# EasyEDA schematic SCH_CLASS_ESP32-S2-MAIN_2024-03-12 (1).json
TITLE: ESP32_S2-MAIN-CONTROL; REV: 1.9; Date: 2023-12-26; Sheet: 1/1; Drawn By: aamirf; Company: Your Company
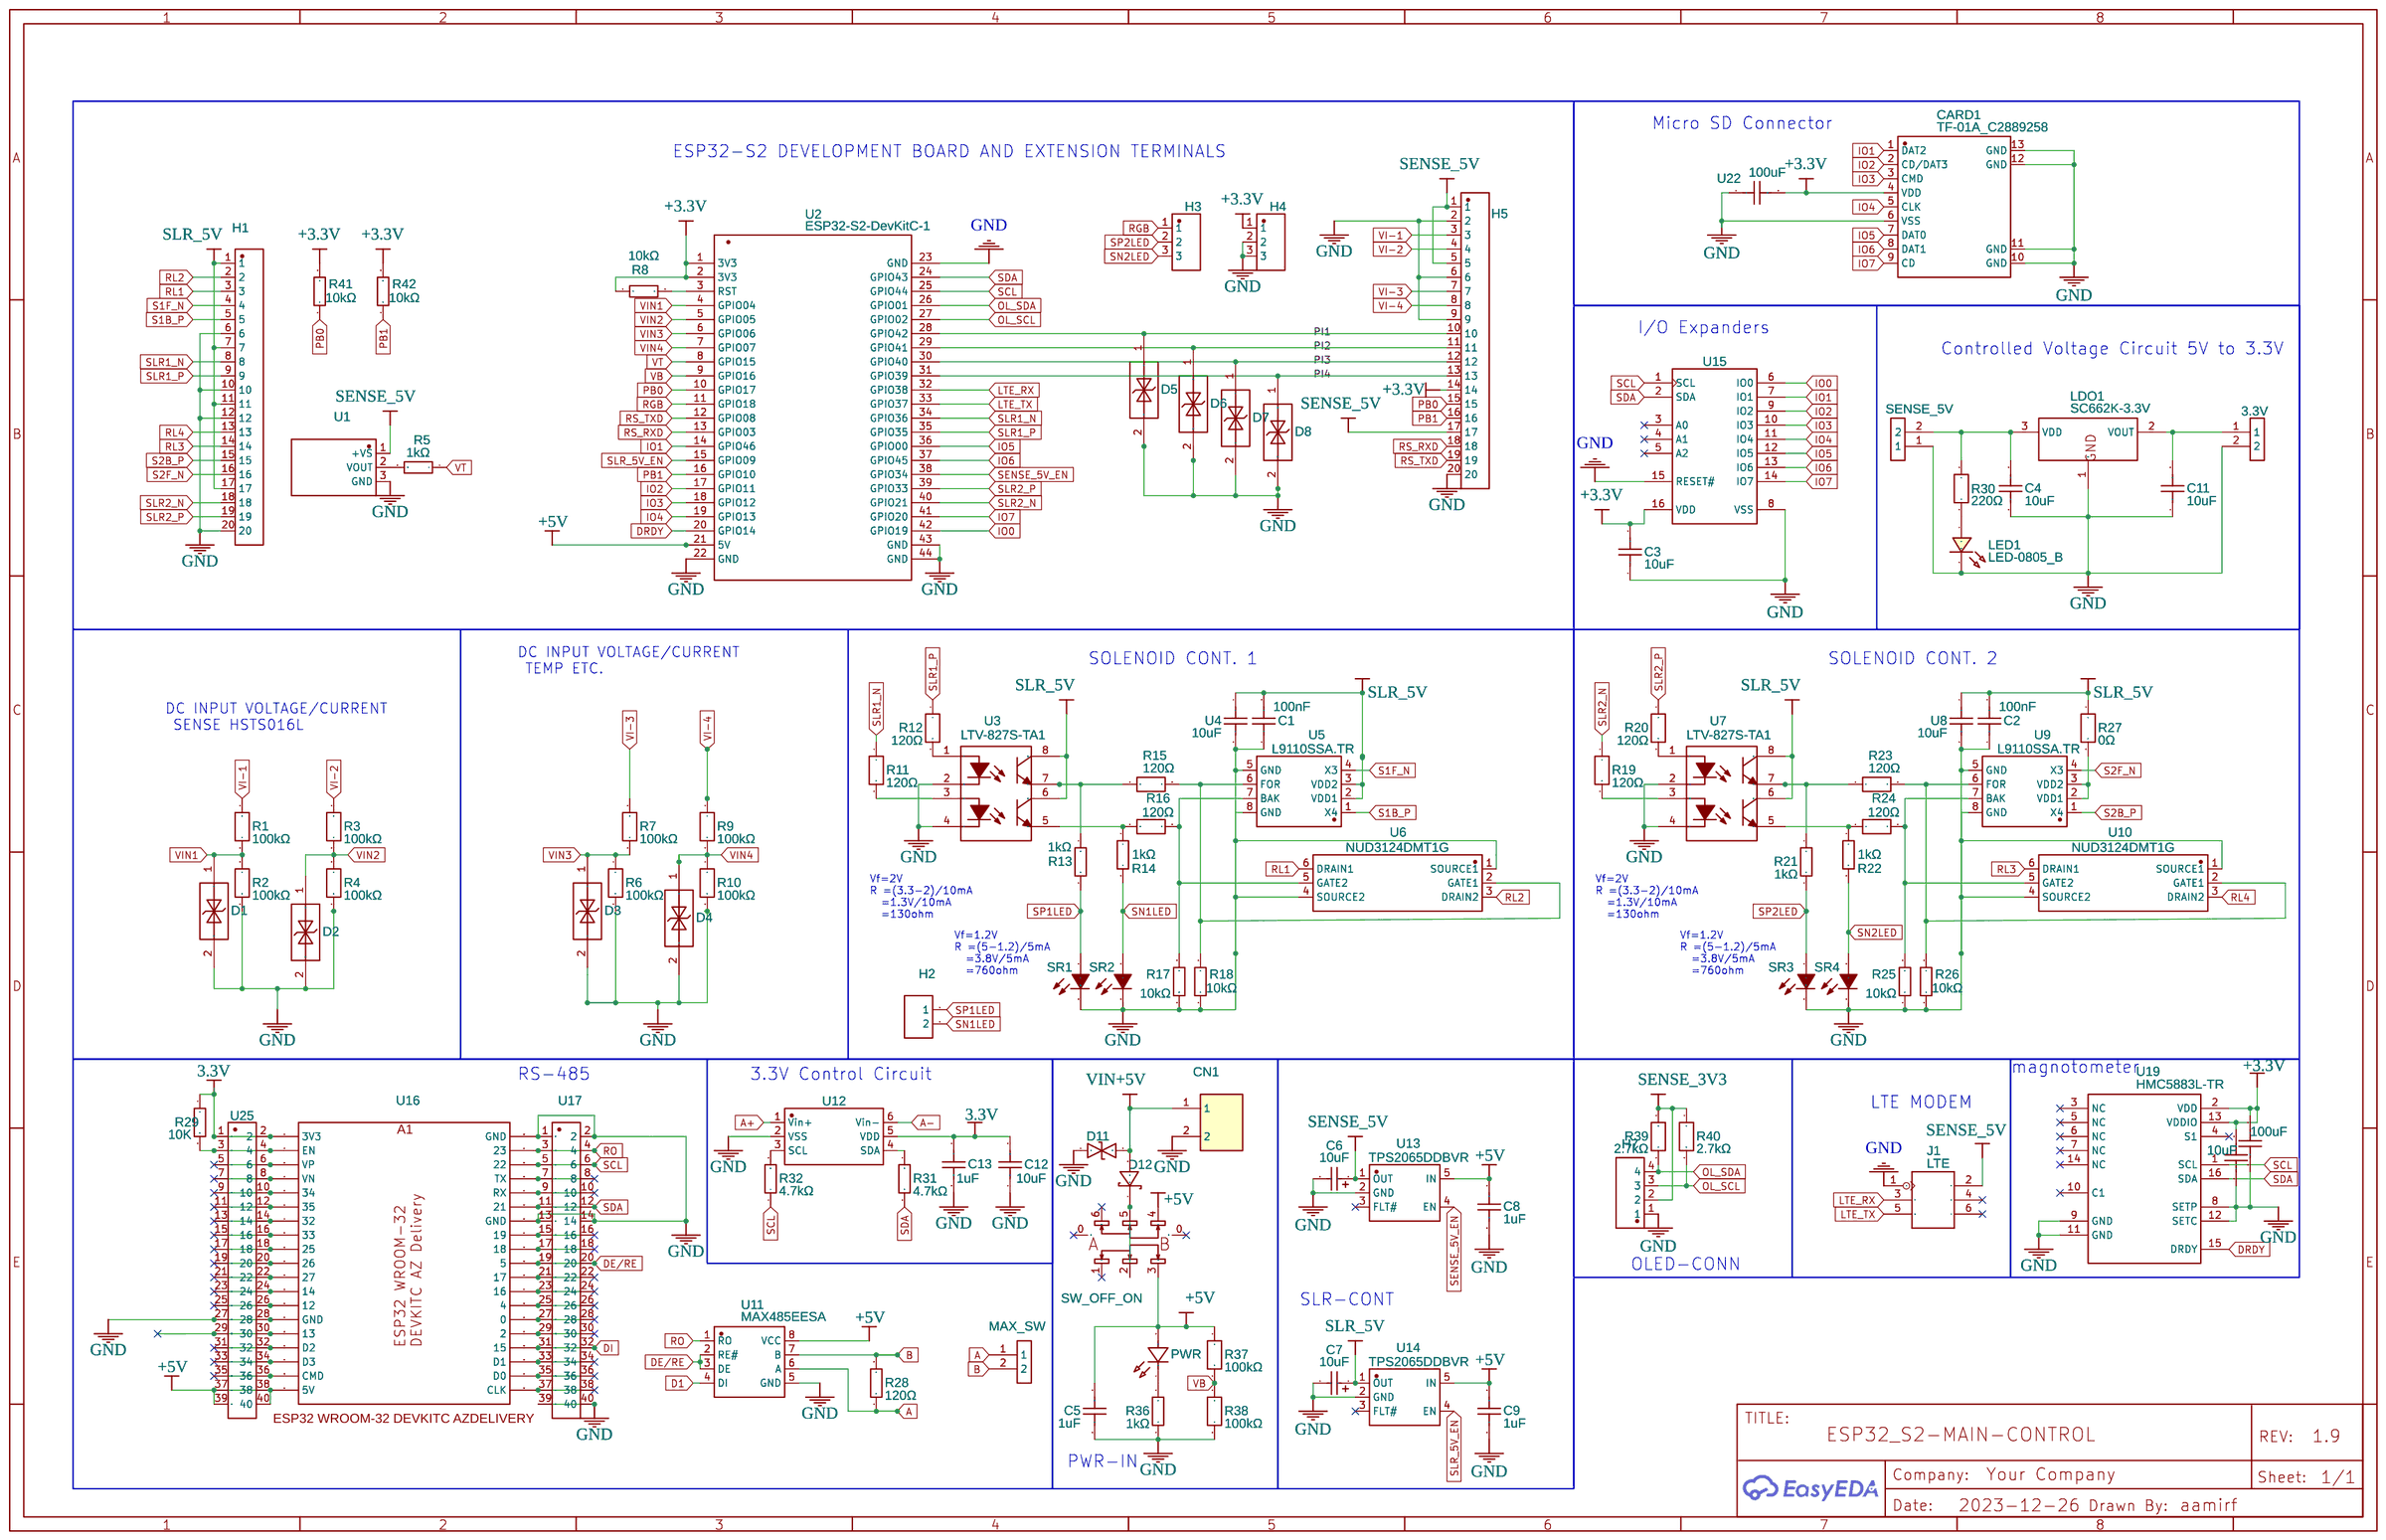
[diagram p0: schematic sheet]

## Parts
C1  100nF  [C0402]
C2  100nF  [C0402]
C3  10uF  [C0805]
C4  10uF  [C0805]
C5  1uF  [C0402]
C6  10uF  [CASE-A_3216]
C7  10uF  [CASE-A_3216]
C8  1uF  [C0402]
C9  1uF  [C0402]
C10  10uF  [C1206]
C11  10uF  [C0805]
C12  10uF  [C0805]
C13  1uF  [C0402]
CARD1  TF-01A_C2889258  [TF-SMD_TF-02]
CN1  B2B-PH-K-S(LF)(SN)  [CONN-TH_B2B-PH-K-S]
D1  KESD5311X  [D0402-BI]
D2  KESD5311X  [D0402-BI]
D3  KESD5311X  [D0402-BI]
D4  KESD5311X  [D0402-BI]
D5  KESD5311X  [D0402-BI]
D6  KESD5311X  [D0402-BI]
D7  KESD5311X  [D0402-BI]
D8  KESD5311X  [D0402-BI]
D11  LESD5D5.0CT1G  [SOD-523_L1.2-W0.8-LS1.6-BI]
D12  BAT760-7  [SOD-323_L1.8-W1.3-LS2.5-RD]
H1  KH-2.54PH180-1X20P-L11.5  [HDR-TH_20P-P2.54-V-M]
H2  HDR-F-2.54_1x2  [HDR-F-2.54_1X2]
H3  KH-2.54PH180-1X3P-L11.5  [HDR-TH_3P-P2.54-V-M]
H4  KH-2.54PH180-1X3P-L11.5  [HDR-TH_3P-P2.54-V-M]
H5  KH-2.54PH180-1X20P-L11.5  [HDR-TH_20P-P2.54-V-M]
H7  X6511WV-04H-C30D60  [HDR-TH_4P-P2.54-V-M]
J1  LTE  [HEADER 2X3-2.54]
LDO1  SC662K-3.3V  [SOT-23-3_L2.9-W1.3-P1.90-LS2.4-BR]
LED1  LED-0805_B  [LED0805_BLUE]
PWR  16-213/BHC-ZL1M2B6Y/3T  [LED0402-RD_BLUE]
PWR_1V  MAX_SW  [CONN-02-5-SMD]
PWR_2V  SENSE_5V  [CONN-02-5-SMD]
PWR_3V  3.3V  [CONN-02-5-SMD]
R1  100kΩ  [R0402]
R2  100kΩ  [R0402]
R3  100kΩ  [R0402]
R4  100kΩ  [R0402]
R5  1kΩ  [R0402]
R6  100kΩ  [R0402]
R7  100kΩ  [R0402]
R8  10kΩ  [R0402]
R9  100kΩ  [R0402]
R10  100kΩ  [R0402]
R11  120Ω  [R0402]
R12  120Ω  [R0402]
R13  1kΩ  [R0402]
R14  1kΩ  [R0402]
R15  120Ω  [R0402]
R16  120Ω  [R0402]
R17  10kΩ  [R0402]
R18  10kΩ  [R0402]
R19  120Ω  [R0402]
R20  120Ω  [R0402]
R21  1kΩ  [R0402]
R22  1kΩ  [R0402]
R23  120Ω  [R0402]
R24  120Ω  [R0402]
R25  10kΩ  [R0402]
R26  10kΩ  [R0402]
R27  0Ω  [R0603]
R28  120Ω  [R0402]
R29  10K  [R0603]
R30  220Ω  [R0402]
R31  4.7kΩ  [R0402]
R32  4.7kΩ  [R0402]
R36  1kΩ  [R0402]
R37  100kΩ  [R0402]
R38  100kΩ  [R0402]
R39  2.7kΩ  [R0402]
R40  2.7kΩ  [R0402]
R41  10kΩ  [R0402]
R42  10kΩ  [R0402]
SR1  16-213/GHC-YR1S1/3T  [LED0402-R-RD]
SR2  16-213/SDRC/S530-A3/TR8  [LED0402-RD]
SR3  16-213/GHC-YR1S1/3T  [LED0402-R-RD]
SR4  16-213/SDRC/S530-A3/TR8  [LED0402-RD]
SW1  SW_OFF_ON  [SW-SMD_6P-L7.7-W5.6-P2.50]
U1  LM35DZ/LFT1  [TO-92-3_L4.8-W3.7-P2.54-L]
U2  ESP32-S2-DevKitC-1  [ESP32-S2-DEVKITC-1]
U3  LTV-827S-TA1  [SMD-8_6.3MM]
U4  10uF  [C0603]
U5  L9110SSA.TR  [SOP-8_L5.0-W3.9-P1.27-LS6.0-BL]
U6  NUD3124DMT1G  [SC-74-6_L3.0-W1.5-P0.95-LS2.8-BL]
U7  LTV-827S-TA1  [SMD-8_6.3MM]
U8  10uF  [C0603]
U9  L9110SSA.TR  [SOP-8_L5.0-W3.9-P1.27-LS6.0-BL]
U10  NUD3124DMT1G  [SC-74-6_L3.0-W1.5-P0.95-LS2.8-BL]
U11  MAX485EESA  [SOIC-8_L5.0-W4.0-P1.27-LS6.0-BL]
U12  MCP3421A0T-E/CH  [SOT-23-6_L2.9-W1.6-P0.95-LS2.8-BR]
U13  TPS2065DDBVR  [SOT-23-5_L3.0-W1.7-P0.95-LS2.8-BL]
U14  TPS2065DDBVR  [SOT-23-5_L3.0-W1.7-P0.95-LS2.8-BL]
U15  PCA9557PW,118  [TSSOP-16_L5.0-W4.4-P0.65-LS6.4-BL]
U16  ESP_32_40_SMD_symbol  [ESP_32_SMD_FOOTPRINT]
U17  SCHLIB_C2685092Connector_SMD_40pin  [C2685092CONNECTOR_SMD_FOOTPRINT]
U18  100uF  [C1206]
U19  HMC5883L-TR  [LGA-16_L3.0-W3.0-P0.50-BL_SQ]
U22  100uF  [C1206]
U25  SCHLIB_C2685092Connector_SMD_40pin  [C2685092CONNECTOR_SMD_FOOTPRINT]

## Library data of the parts
C1 C2 = C1005X5R0J104K050BA: Contributor: lcsc; Supplier: LCSC; Supplier Part: C3845188; Manufacturer: TDK; link: https://lcsc.com/eda_search?q=C3845188&%26type=1&ref=editor
C3 C12 = C2012X5R1E106M125AB: Contributor: lcsc; Supplier: LCSC; Supplier Part: C3853143; Manufacturer: TDK
C4 C11 = C2012JB1E106K085AC: Contributor: lcsc; Supplier: LCSC; Supplier Part: C3902947; Manufacturer: TDK
C5 C8 C9 C13 = GRM155R61H105ME05D: Contributor: lcsc; Supplier: LCSC; Supplier Part: C5119299; Manufacturer: muRata(村田); JLCPCB Part Class: Extended Part; link: https://lcsc.com/eda_search?q=C5119299&%26type=1&ref=editor
C6 C7 = CA45A-A-16V-10UF-K: Contributor: LCSC; Supplier: LCSC; Manufacturer: CEC(振华新云); Manufacturer Part: CA45A-A-16V-10uF-K; Supplier Part: C129279; JLCPCB Part Class: Extended Part
C10 = C3216JB1C106M085AB: Contributor: lcsc; Supplier: LCSC; Supplier Part: C3874147; Manufacturer: TDK
CARD1 = TF-01A_C2889258: Contributor: LCSC; Supplier: LCSC; Supplier Part: C2889258; Manufacturer: Yuandi(台湾元迪); Manufacturer Part: TF-01A; JLCPCB Part Class: Extended Part
CN1 = B2B-PH-K-S(LF)(SN): Contributor: LCSC; Supplier: LCSC; Manufacturer: JST; Supplier Part: C131337; JLCPCB Part Class: Extended Part; link: https://lcsc.com/eda_search?q=C131337&%26type=1&ref=editor
D1-D8 = KESD5311X: Contributor: lcsc; Supplier: LCSC; Supplier Part: C2892495; Manufacturer: KUU; JLCPCB Part Class: Extended Part
D11 = LESD5D5.0CT1G: Contributor: LCSC; Supplier: LCSC; Supplier Part: C383211; Manufacturer: LRC(乐山无线电); JLCPCB Part Class: Extended Part; link: https://lcsc.com/eda_search?q=C383211&%26type=1&ref=editor
D12 = BAT760-7: Contributor: LCSC; Supplier: LCSC; Manufacturer: DIODES(美台); Supplier Part: C124187; JLCPCB Part Class: Extended Part; link: https://lcsc.com/eda_search?q=C124187&%26type=1&ref=editor
H1 H5 = KH-2.54PH180-1X20P-L11.5: Contributor: LCSC; Supplier: LCSC; Supplier Part: C2905493; Manufacturer: kinghelm(金航标); JLCPCB Part Class: Extended Part
H2 = HDR-F-2.54_1x2: Supplier Part: C49661; Supplier: LCSC; Contributor: LCEDA_Lib
H3 H4 = KH-2.54PH180-1X3P-L11.5: Contributor: LCSC; Supplier: LCSC; Supplier Part: C2932698; Manufacturer: kinghelm(金航标); JLCPCB Part Class: Extended Part
H7 = X6511WV-04H-C30D60: Contributor: LCSC; Supplier: LCSC; Supplier Part: C706876; Manufacturer: XKB Connectivity(中国星坤); JLCPCB Part Class: Extended Part
J1 = MALE-HEADER(2X3P-2.54): Contributor: hphoa
LDO1 = SC662K-3.3V: Supplier: LCSC; Manufacturer: FM(富满); Supplier Part: C83932; JLCPCB Part Class: Extended Part
LED1 = LED-0805_B: Manufacturer: 方舟 ARKLED; Manufacturer Part: D-B080508B1-KS2; Supplier Part: C108412; Contributor: LCEDA_Lib
PWR = 16-213/BHC-ZL1M2B6Y/3T: Contributor: lcsc; Supplier: LCSC; Supplier Part: C2844007; Manufacturer: EVERLIGHT(亿光); JLCPCB Part Class: Extended Part
PWR_1V PWR_2V PWR_3V = CONN-02-5-SMD: Manufacturer Part: 950-D-SMD-DS/02; Supplier: Digi-Key; Supplier Part: 3072-950-D-SMD-DS/02-ND; link: https://wecoconnectors.com/wp-content/uploads/pdf_sheets_en/950-D-SMD-DS_en.pdf; Contributor: mubashirlio
R1-R4 R6 R7 R9 R10 R37 R38 = CQ02WGJ0104TCE: Contributor: LCSC; Supplier: LCSC; Supplier Part: C966710; Manufacturer: UNI-ROYAL(厚声); JLCPCB Part Class: Extended Part; link: https://lcsc.com/eda_search?q=C966710&%26type=1&ref=editor
R5 R13 R14 R21 R22 R36 = AR02DTD1001: Contributor: LCSC; Supplier: LCSC; Supplier Part: C319807; Manufacturer: Viking(光颉); JLCPCB Part Class: Extended Part; link: https://lcsc.com/eda_search?q=C319807&%26type=1&ref=editor
R8 R17 R18 R25 R26 R41 R42 = 0402WGF1002TCE: Supplier: LCSC; Manufacturer: UNI-ROYAL(厚声); Supplier Part: C25744; JLCPCB Part Class: Basic Part; link: https://lcsc.com/eda_search?q=C25744&%26type=1&ref=editor; Package Display: No
R11 R12 R15 R16 R19 R20 R23 R24 = RM04FTN1200: Contributor: LCSC; Supplier: LCSC; Supplier Part: C432822; Manufacturer: 大毅科技; JLCPCB Part Class: Extended Part; link: https://lcsc.com/eda_search?q=C432822&%26type=1&ref=editor
R27 = CR-03JA7----0R: Contributor: LCSC; Supplier: LCSC; Supplier Part: C465460; Manufacturer: Viking(光颉); JLCPCB Part Class: Extended Part; link: https://lcsc.com/eda_search?q=C465460&%26type=1&ref=editor
R28 = TR0402D120RQ1050: Contributor: LCSC; Supplier: LCSC; Supplier Part: C149900; Manufacturer: EVER OHMS(天二科技); Manufacturer Part: TR0402D120RQ1050Z; JLCPCB Part Class: Extended Part
R29 = RTT12621JTP: Supplier: LCSC; Manufacturer: RALEC(旺诠); Supplier Part: C105036; Resistance (Ohms): 620; JLCPCB Part Class: Extended Part
R30 = CRCW0402220RFKED: Contributor: LCSC; Supplier: LCSC; Supplier Part: C482103; Manufacturer: VISHAY(威世); JLCPCB Part Class: Extended Part
R31 R32 = RC0402FR-074K7L: Supplier: LCSC; Manufacturer: YAGEO(国巨); Supplier Part: C105871; JLCPCB Part Class: Extended Part
R39 R40 = CR-02FL6---2K7: Contributor: LCSC; Supplier: LCSC; Supplier Part: C409687; Manufacturer: Viking(光颉); JLCPCB Part Class: Extended Part; link: https://lcsc.com/eda_search?q=C409687&%26type=1&ref=editor
SR1 SR3 = 16-213/GHC-YR1S1/3T: Supplier: LCSC; Manufacturer: EVERLIGHT(亿光); Supplier Part: C74338; JLCPCB Part Class: Extended Part
SR2 SR4 = 16-213/SDRC/S530-A3/TR8: Supplier: LCSC; Manufacturer: EVERLIGHT(亿光); Manufacturer Part: 16-213SDRC/S530-A3/TR8; Supplier Part: C71911; JLCPCB Part Class: Extended Part
SW1 = TA-3519S-A1: Contributor: LCSC; Supplier: LCSC; Supplier Part: C514002; Manufacturer: Yuandi(元迪); JLCPCB Part Class: Extended Part; link: https://lcsc.com/eda_search?q=C514002&%26type=1&ref=editor
U1 = LM35DZ/LFT1: Contributor: LCSC; Supplier: LCSC; Manufacturer: TI(德州仪器); Supplier Part: C181511; JLCPCB Part Class: Extended Part; link: https://lcsc.com/eda_search?q=C181511&%26type=1&ref=editor
U2 = ESP32-S2-DevKitC-1: Manufacturer: Espressif Manifacturer; Supplier: Mouser; link: https://www.espressif.com/en/products/socs/esp32-s2; Contributor: kung
U3 U7 = -: Supplier: LCSC; Manufacturer: LITEON; Supplier Part: C22112; Package Display: No
U4 U8 = CGB3C1JB0J106M065AC: Contributor: lcsc; Supplier: LCSC; Supplier Part: C3853014; Manufacturer: TDK; link: https://lcsc.com/eda_search?q=C3853014&%26type=1&ref=editor
U5 U9 = L9110SSA.TR: Supplier: LCSC; Supplier Part: C2977409; Manufacturer: I-CORE(中微爱芯); link: https://atta.szlcsc.com//upload/public/pdf/source/20220218/3C4A07BB3A14956AC9371DCD7606795B.pdf; Contributor: LCSC; JLCPCB Part Class: Extended Part
U6 U10 = NUD3124DMT1G: Supplier: LCSC; Supplier Part: C182473; Manufacturer: ON Semicon; Contributor: LCSC; JLCPCB Part Class: Extended Part
U11 = MAX485EESA: Contributor: lcsc; Supplier: LCSC; Supplier Part: C3213763; Manufacturer: ADI(亚德诺)/MAXIM(美信)
U12 = MCP3421A0T-E/CH: Contributor: KiCad; Supplier: LCSC; Manufacturer: MICROCHIP(美国微芯); Supplier Part: C29454; JLCPCB Part Class: Extended Part
U13 U14 = TPS2065DDBVR: Contributor: LCSC; Supplier: LCSC; Supplier Part: C414625; Manufacturer: TI(德州仪器); JLCPCB Part Class: Extended Part
U15 = PCA9557PW,118: Contributor: LCSC; Supplier: LCSC; Manufacturer: NXP(恩智浦); Supplier Part: C141380; JLCPCB Part Class: Extended Part
U16 = ESP_32_40_SMD_symbol: Contributor: aamirf
U17 U25 = SCHLIB_C2685092Connector_SMD_40pin: Contributor: mubashirlio
U18 U22 = C1206X5R107K6R3NT: Contributor: lcsc; Supplier: LCSC; Supplier Part: C2844390; Manufacturer: SANYEAR(叁叶源); JLCPCB Part Class: Extended Part
U19 = HMC5883L-TR: Supplier: LCSC; Manufacturer: null; Supplier Part: C15640; JLCPCB Part Class: Extended Part

## Nets
3.3V: C12.2 C13.1 R29.1 U12.5(VDD) U16.1(3V3) U25.1 U25.2
+3.3V: C3.2 C10.2 CARD1.4(VDD) H4.1 H5.14 R8.1 R41.2 R42.2 U2.1(3V3) U2.2(3V3) U15.16(VDD) U18.2 U19.2(VDD) U19.13(VDDIO) U22.2
+5V: C5.1 C8.1 C9.1 PWR.2(A) R37.1 SW1.3 SW1.4 U2.21(5V) U11.8(VCC) U13.5(IN) U14.5(IN) U16.19(5V) U25.37 U25.38 U25.39 U25.40
GND: C1.1 C2.1 C3.1 C4.1 C5.2 C6.2 C7.2 C8.2 C9.2 C10.1 C11.1 C12.1 C13.2 CARD1.6(VSS) CARD1.10(GND) CARD1.11(GND) CARD1.12(GND) CARD1.13(GND) CN1.2 D1.2 D2.2 D3.2 D4.2 D5.2 D6.2 D7.2 D8.2 D11.1 H1.6 H1.10 H1.12 H1.20 H4.2 H4.3 H5.2 H5.6 H5.9 H5.20 H7.1 J1.1 LDO1.1(GND) LED1.2 PWR_2V.1 PWR_3V.2 R2.2 R4.2 R6.2 R10.2 R17.1 R18.1 R25.1 R26.1 R36.2 R38.2 SR1.2(C) SR2.1(-) SR3.2(C) SR4.1(-) U1.3(GND) U2.22(GND) U2.23(GND) U2.43(GND) U2.44(GND) U3.2 U3.4 U4.2 U5.5(GND) U5.8(GND) U6.1(SOURCE1) U6.4(SOURCE2) U7.2 U7.4 U8.2 U9.5(GND) U9.8(GND) U10.1(SOURCE1) U10.4(SOURCE2) U11.5(GND) U12.2(VSS) U13.2(GND) U14.2(GND) U15.8(VSS) U15.15(RESET#) U16.14(GND) U16.32(GND) U16.38(GND) U17.1 U17.2 U17.13 U17.14 U17.39 U17.40 U18.1 U19.8(SETP) U19.9(GND) U19.11(GND) U19.12(SETC) U22.1 U25.27 U25.28
VIN1: D1.1 R1.2 R2.1 U2.4(GPIO04)
VIN2: D2.1 R3.2 R4.1 U2.5(GPIO05)
VIN3: D3.1 R6.1 R7.2 U2.6(GPIO06)
VIN4: D4.1 R9.2 R10.1 U2.7(GPIO07)
VIN+5V: CN1.1 D11.2 D12.2
A: PWR_1V.1 R28.1 U11.6(A)
A+: U12.1(Vin+)
A-: U12.6(Vin-)
B: PWR_1V.2 R28.2 U11.7(B)
D1: U11.4(DI)
DE/RE: U11.2(RE#) U11.3(DE) U16.29(5) U17.19 U17.20
DI: U16.23(15) U17.31 U17.32
DRDY: U2.20(GPIO14) U19.15(DRDY)
IO0: U2.42(GPIO19) U15.6(IO0)
IO1: CARD1.1(DAT2) U2.14(GPIO46) U15.7(IO1)
IO2: CARD1.2(CD/DAT3) U2.17(GPIO11) U15.9(IO2)
IO3: CARD1.3(CMD) U2.18(GPIO12) U15.10(IO3)
IO4: CARD1.5(CLK) U2.19(GPIO13) U15.11(IO4)
IO5: CARD1.7(DAT0) U2.36(GPIO00) U15.12(IO5)
IO6: CARD1.8(DAT1) U2.37(GPIO45) U15.13(IO6)
IO7: CARD1.9(CD) U2.41(GPIO20) U15.14(IO7)
LTE_RX: J1.3(2) U2.32(GPIO38)
LTE_TX: J1.5(3) U2.33(GPIO37)
OL_SCL: H7.3 R40.2 U2.27(GPIO02)
OL_SDA: H7.4 R39.2 U2.26(GPIO01)
PB0: H5.15 R41.1 U2.10(GPIO17)
PB1: H5.16 R42.1 U2.16(GPIO10)
PI1: D5.1 H5.10 U2.28(GPIO42)
PI2: D6.1 H5.11 U2.29(GPIO41)
PI3: D7.1 H5.12 U2.30(GPIO40)
PI4: D8.1 H5.13 U2.31(GPIO39)
RGB: H3.1 U2.11(GPIO18)
RL1: H1.3 U6.6(DRAIN1)
RL2: H1.2 U6.3(DRAIN2)
RL3: H1.14 U10.6(DRAIN1)
RL4: H1.13 U10.3(DRAIN2)
RO: U11.1(RO) U16.37(23) U17.3 U17.4
RS_RXD: H5.18 U2.13(GPIO03)
RS_TXD: H5.19 U2.12(GPIO08)
S1B_P: H1.5 U5.1(X4)
S1F_N: H1.4 U5.4(X3)
S2B_P: H1.15 U9.1(X4)
S2F_N: H1.16 U9.4(X3)
SCL: R32.1 U2.25(GPIO44) U15.1(SCL) U16.36(22) U17.5 U17.6 U19.1(SCL)
SDA: R31.2 U2.24(GPIO43) U15.2(SDA) U16.33(21) U17.11 U17.12 U19.16(SDA)
SENSE_3V3: H7.2 R39.1 R40.1
SENSE_5V: C6.1 H5.1 H5.5 H5.17 J1.2(6) U1.1(+VS) U13.1(OUT)
SENSE_5V_EN: U2.38(GPIO34) U13.4(EN)
SLR1_N: H1.8 R11.1 U2.34(GPIO36)
SLR1_P: H1.9 R12.1 U2.35(GPIO35)
SLR2_N: H1.18 R19.1 U2.40(GPIO21)
SLR2_P: H1.19 R20.1 U2.39(GPIO33)
SLR_5V: C1.2 C2.2 C7.1 H1.1 H1.7 H1.11 H1.17 R27.1 U3.6 U3.8 U4.1 U5.2(VDD1) U5.3(VDD2) U7.6 U7.8 U8.1 U14.1(OUT)
SLR_5V_EN: U2.15(GPIO09) U14.4(EN)
SN1LED: H2.2 R14.2 SR2.2(+)
SN2LED: H3.3 R22.2 SR4.2(+)
SP1LED: H2.1 R13.2 SR1.1(A)
SP2LED: H3.2 R21.2 SR3.1(A)
VB: R37.2 R38.1 U2.9(GPIO16)
VI-1: H5.3 R1.1
VI-2: H5.4 R3.1
VI-3: H5.7 R7.1
VI-4: H5.8 R9.1
VT: R5.1 U2.8(GPIO15)
Net-(C4-2): C4.2 LDO1.3(VDD) PWR_2V.2 R30.2
Net-(C11-2): C11.2 LDO1.2(VOUT) PWR_3V.1
Net-(D12-1): D12.1 SW1.2 SW1.5
Net-(LED1-1): LED1.1 R30.1
Net-(PWR-1): PWR.1(K) R36.1
Net-(R5-2): R5.2 U1.2(VOUT)
Net-(R8-2): R8.2 U2.3(RST)
Net-(R11-2): R11.2 U3.3
Net-(R12-2): R12.2 U3.1
Net-(R13-1): R13.1 R15.1 U3.7
Net-(R14-1): R14.1 R16.1 U3.5
Net-(R15-2): R15.2 R18.2 U5.6(FOR) U6.2(GATE1)
Net-(R16-2): R16.2 R17.2 U5.7(BAK) U6.5(GATE2)
Net-(R19-2): R19.2 U7.3
Net-(R20-2): R20.2 U7.1
Net-(R21-1): R21.1 R23.1 U7.7
Net-(R22-1): R22.1 R24.1 U7.5
Net-(R23-2): R23.2 R26.2 U9.6(FOR) U10.2(GATE1)
Net-(R24-2): R24.2 R25.2 U9.7(BAK) U10.5(GATE2)
Net-(R27-2): R27.2 U9.2(VDD1) U9.3(VDD2)
Net-(R29-2): R29.2 U16.2(EN) U25.3 U25.4
Net-(R31-1): R31.1 U12.4(SDA)
Net-(R32-2): R32.2 U12.3(SCL)
Net-(U16-3): U16.3(VP) U25.5 U25.6
Net-(U16-4): U16.4(VN) U25.7 U25.8
Net-(U16-5): U16.5(34) U25.9 U25.10
Net-(U16-6): U16.6(35) U25.11 U25.12
Net-(U16-7): U16.7(32) U25.13 U25.14
Net-(U16-8): U16.8(33) U25.15 U25.16
Net-(U16-9): U16.9(25) U25.17 U25.18
Net-(U16-10): U16.10(26) U25.19 U25.20
Net-(U16-11): U16.11(27) U25.21 U25.22
Net-(U16-12): U16.12(14) U25.23 U25.24
Net-(U16-13): U16.13(12) U25.25 U25.26
Net-(U16-15): U16.15(13) U25.29 U25.30
Net-(U16-16): U16.16(D2) U25.31 U25.32
Net-(U16-17): U16.17(D3) U25.33 U25.34
Net-(U16-18): U16.18(CMD) U25.35 U25.36
Net-(U16-20): U16.20(CLK) U17.37 U17.38
Net-(U16-21): U16.21(D0) U17.35 U17.36
Net-(U16-22): U16.22(D1) U17.33 U17.34
Net-(U16-24): U16.24(2) U17.29 U17.30
Net-(U16-25): U16.25(0) U17.27 U17.28
Net-(U16-26): U16.26(4) U17.25 U17.26
Net-(U16-27): U16.27(16) U17.23 U17.24
Net-(U16-28): U16.28(17) U17.21 U17.22
Net-(U16-30): U16.30(18) U17.17 U17.18
Net-(U16-31): U16.31(19) U17.15 U17.16
Net-(U16-34): U16.34(RX) U17.9 U17.10
Net-(U16-35): U16.35(TX) U17.7 U17.8

Not connected (* = marked no-connect by the designer): J1 4(5)* 6(4)*; SW1 0* 1* 6*; U13 3(FLT#)*; U14 3(FLT#)*; U15 3(A0)* 4(A1)* 5(A2)*; U19 3(NC)* 4(S1)* 5(NC)* 6(NC)* 7(NC)* 10(C1)* 14(NC)*

## Notes on the sheet
- Micro SD Connector
- ESP32-S2 DEVELOPMENT BOARD AND EXTENSION TERMINALS
- I/O Expanders
- Controlled Voltage Circuit 5V to 3.3V
- DC INPUT VOLTAGE/CURRENT
   TEMP ETC.
- SOLENOID CONT. 1
- SOLENOID CONT. 2
- DC INPUT VOLTAGE/CURRENT
   SENSE HSTS016L
- Vf=2V
  R =(3.3-2)/10mA
    =1.3V/10mA
    =130ohm
- Vf=2V
  R =(3.3-2)/10mA
    =1.3V/10mA
    =130ohm
- Vf=1.2V
  R =(5-1.2)/5mA
    =3.8V/5mA
    =760ohm
- Vf=1.2V
  R =(5-1.2)/5mA
    =3.8V/5mA
    =760ohm
- magnotometer
- RS-485
- 3.3V Control Circuit
- LTE MODEM
- OLED-CONN
- SLR-CONT
- PWR-IN
